# EAGLE schematic EyeTron (EAGLE 9.5.1)
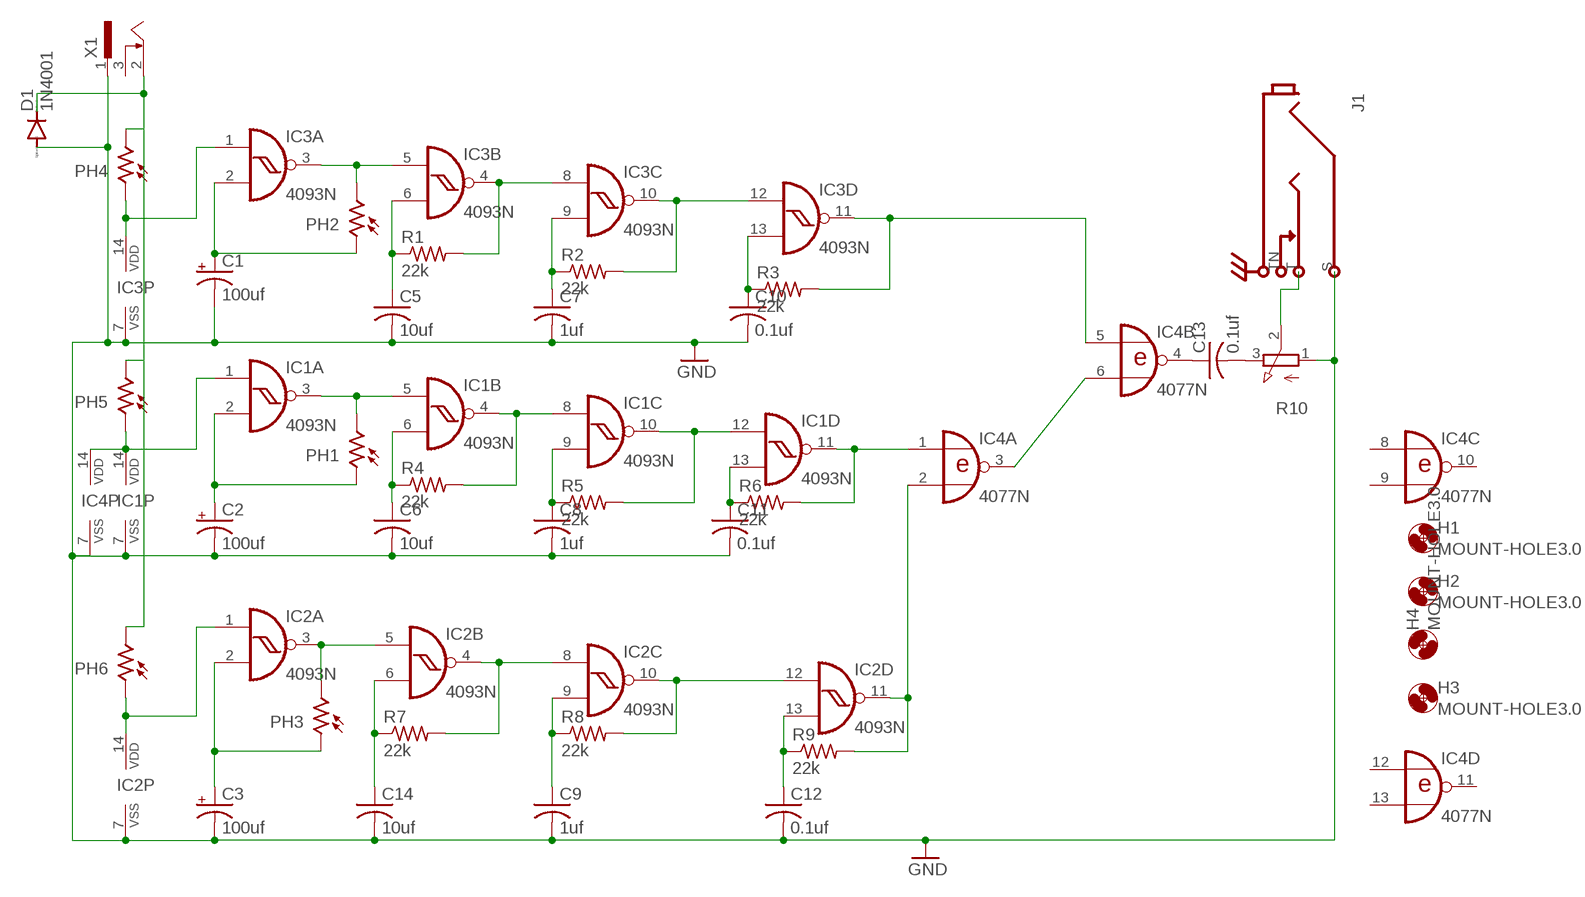
[diagram p0: schematic, sheet 1]

## Parts
C1  100uf  CPOL-USE2,5-6E  [E2,5-6E]
C2  100uf  CPOL-USE2,5-6E  [E2,5-6E]
C3  100uf  CPOL-USE2,5-6E  [E2,5-6E]
C5  10uf  C-US050-025X075  [C050-025X075]
C6  10uf  C-US050-025X075  [C050-025X075]
C7  1uf  C-US050-025X075  [C050-025X075]
C8  1uf  C-US050-025X075  [C050-025X075]
C9  1uf  C-US050-025X075  [C050-025X075]
C10  0.1uf  C-US050-025X075  [C050-025X075]
C11  0.1uf  C-US050-025X075  [C050-025X075]
C12  0.1uf  C-US050-025X075  [C050-025X075]
C13  0.1uf  C-US050-025X075  [C050-025X075]
C14  10uf  C-US050-025X075  [C050-025X075]
D1  1N4001  1N4004  [DO41-10]
H1  MOUNT-HOLE3.0  [3,0]
H2  MOUNT-HOLE3.0  [3,0]
H3  MOUNT-HOLE3.0  [3,0]
H4  MOUNT-HOLE3.0  [3,0]
IC1  4093N  [DIL14]
IC2  4093N  [DIL14]
IC3  4093N  [DIL14]
IC4  4077N  [DIL14]
J1  MONOSW1GND  [NEUTRIK-NRJ4HM-1]
PH1  VT90N1  [VT900]
PH2  VT90N1  [VT900]
PH3  VT90N1  [VT900]
PH4  VT90N1  [VT900]
PH5  VT90N1  [VT900]
PH6  VT90N1  [VT900]
R1  22k  R-US_0207/7  [0207/7]
R2  22k  R-US_0207/7  [0207/7]
R3  22k  R-US_0207/7  [0207/7]
R4  22k  R-US_0207/7  [0207/7]
R5  22k  R-US_0207/7  [0207/7]
R6  22k  R-US_0207/7  [0207/7]
R7  22k  R-US_0207/7  [0207/7]
R8  22k  R-US_0207/7  [0207/7]
R9  22k  R-US_0207/7  [0207/7]
R10  EVUF2L  [EVUFXL]
X1  SCD-014A  [SCD-014-A]

## Nets
GND: C1.- C2.- C3.- C5.2 C6.2 C7.2 C8.2 C9.2 C10.2 C11.2 C12.2 C14.2 D1.A IC1.7(P:VSS) IC2.7(P:VSS) IC3.7(P:VSS) IC4.7(P:VSS) J1.S R10.1(A) X1.1
N$1: IC1.11(D:O) IC4.1(A:I0) R6.2
N$2: IC1.10(C:O) IC1.12(D:I0) R5.2
N$3: IC1.4(B:O) IC1.8(C:I0) R4.2
N$4: IC1.3(A:O) IC1.5(B:I0) PH1.2
N$5: IC2.3(A:O) IC2.5(B:I0) PH3.2
N$6: IC2.4(B:O) IC2.8(C:I0) R7.2
N$7: IC2.10(C:O) IC2.12(D:I0) R8.2
N$8: IC2.11(D:O) IC4.2(A:I1) R9.2
N$9: IC4.3(A:O) IC4.6(B:I1)
N$10: IC3.3(A:O) IC3.5(B:I0) PH2.2
N$11: IC3.4(B:O) IC3.8(C:I0) R1.2
N$12: IC3.10(C:O) IC3.12(D:I0) R2.2
N$13: IC3.11(D:O) IC4.5(B:I0) R3.2
N$14: C1.+ IC3.2(A:I1) PH2.1
N$15: C2.+ IC1.2(A:I1) PH1.1
N$16: C3.+ IC2.2(A:I1) PH3.1
N$17: C5.1 IC3.6(B:I1) R1.1
N$19: C7.1 IC3.9(C:I1) R2.1
N$20: IC3.1(A:I0) IC3.14(P:VDD) PH4.1
N$21: C10.1 IC3.13(D:I1) R3.1
N$22: IC1.1(A:I0) IC1.14(P:VDD) IC4.14(P:VDD) PH5.1
N$23: C6.1 IC1.6(B:I1) R4.1
N$24: C8.1 IC1.9(C:I1) R5.1
N$25: C11.1 IC1.13(D:I1) R6.1
N$26: C14.1 IC2.6(B:I1) R7.1
N$27: C9.1 IC2.9(C:I1) R8.1
N$28: C12.1 IC2.13(D:I1) R9.1
N$29: IC2.1(A:I0) IC2.14(P:VDD) PH6.1
N$30: D1.C PH4.2 PH5.2 PH6.2 X1.2
N$31: C13.1 IC4.4(B:O)
N$32: C13.2 R10.3(E)
N$33: J1.T R10.2(S)
Unconnected: IC4.8(C:I0) IC4.9(C:I1) IC4.10(C:O) IC4.11(D:O) IC4.12(D:I0) IC4.13(D:I1) J1.TN X1.3

## Library data of the parts
C1-C3 = rcl:CPOL-US: POLARIZED CAPACITOR, American symbol; SPICEPREFIX: C
C5-C14 = rcl:C-US: CAPACITOR, American symbol; SPICEPREFIX: C
D1 = diode:1N4004: DIODE general purpose rectifier, 1 A
H1-H4 = holes:MOUNT-HOLE: MOUNTING HOLE with drill center marker
IC1 IC2 = 40xx:4093: Quad 2-input NAND schmitt trigger
IC3 = 40xx:4093: Quad 2-input NAND schmitt trigger; SPICEPREFIX: J
IC4 = 40xx:4077: Quad XNOR
J1 = Audio Jacks 0.25 inch:MONOSW1GND: 1/4" mono jack, switched (unswitched sleeve), with chassis ground connection
PH1-PH6 = photo-elements:VT9: Photoconductive Cell VT900 Series Source: http://optoelectronics.perkinelmer.com/content/Datasheets/DTS_vt900seriesdatasheet.pdf
R1-R9 = rcl:R-US_: RESISTOR, American symbol; SPICEPREFIX: R
R10 = pot:EVU: 9 mm Square Rotary Potentiometers Source: Panasonic
X1 = con-shiua-chyuan:SCD-014A: Power Jack 2.5mm; OC_FARNELL: unknown; OC_NEWARK: unknown